# Altium project Full_Power_Board.PrjPcb
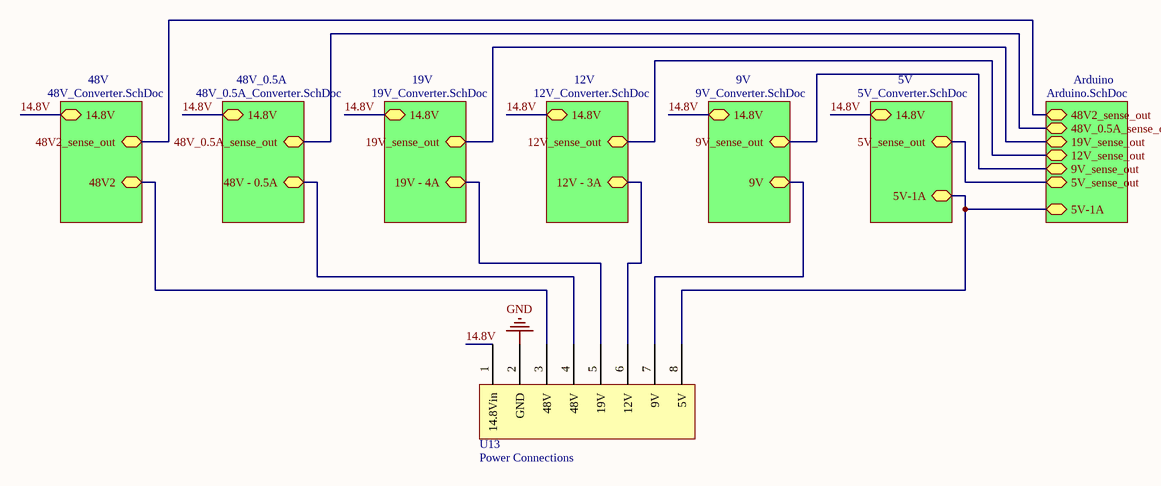
[diagram p0: Full_Power_Board.SchDoc]
2 sheets, 6 parts. Net scope: hierarchical (ports join the sheet entries above them; power ports are global).
Board file: Full_Power_Board.PcbDoc
Sheets:
  Full_Power_Board.SchDoc
    5V = 5V_Converter.SchDoc

## Sheet Full_Power_Board.SchDoc
size A

### Parts
U13  Power Connections  [Molex Connector]

### Sub-sheets
5V = 5V_Converter.SchDoc: 14.8V, 5V_sense_out, 5V-1A
9V = 9V_Converter.SchDoc (file not in this document): 14.8V, 9V_sense_out, 9V
12V = 12V_Converter.SchDoc (file not in this document): 14.8V, 12V_sense_out, 12V - 3A
19V = 19V_Converter.SchDoc (file not in this document): 14.8V, 19V_sense_out, 19V - 4A
48V = 48V_Converter.SchDoc (file not in this document): 14.8V, 48V2, 48V2_sense_out
48V_0.5A = 48V_0.5A_Converter.SchDoc (file not in this document): 14.8V, 48V - 0.5A, 48V_0.5A_sense_out
Arduino = Arduino.SchDoc (file not in this document): 5V-1A, 5V_sense_out, 9V_sense_out, 12V_sense_out, 19V_sense_out, 48V_0.5A_sense_out, 48V2_sense_out

### Nets
GND: U13.2(GND)
14.8V: U13.1(14.8Vin) ; sheet 48V/14.8V, sheet 48V_0.5A/14.8V, sheet 19V/14.8V, sheet 12V/14.8V, sheet 9V/14.8V, sheet 5V/14.8V
NetR1_2: U13.8(5V) ; sheet 5V/5V-1A, sheet Arduino/5V-1A
NetU2_5: sheet 5V/5V_sense_out, sheet Arduino/5V_sense_out
NetU13_3: U13.3(48V) ; sheet 48V/48V2
NetU13_4: U13.4(48V) ; sheet 48V_0.5A/48V - 0.5A
NetU13_5: U13.5(19V) ; sheet 19V/19V - 4A
NetU13_6: U13.6(12V) ; sheet 12V/12V - 3A
NetU13_7: U13.7(9V) ; sheet 9V/9V
(unnamed): sheet 48V/48V2_sense_out, sheet Arduino/48V2_sense_out
(unnamed): sheet 48V_0.5A/48V_0.5A_sense_out, sheet Arduino/48V_0.5A_sense_out
(unnamed): sheet 19V/19V_sense_out, sheet Arduino/19V_sense_out
(unnamed): sheet 12V/12V_sense_out, sheet Arduino/12V_sense_out
(unnamed): sheet 9V/9V_sense_out, sheet Arduino/9V_sense_out

### Library data of the parts
U13 = Molex Connector

## Sheet 5V_Converter.SchDoc
size A
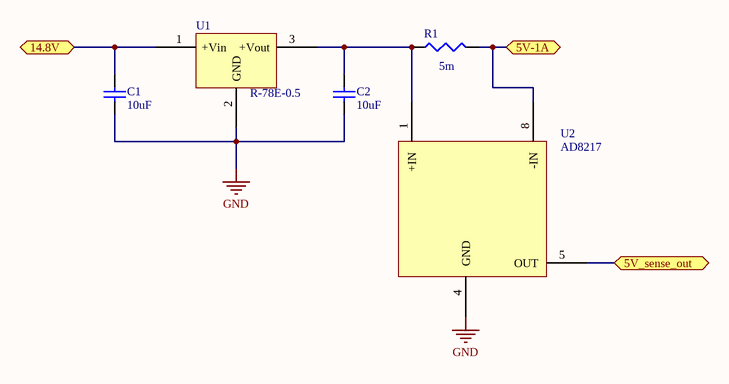
[diagram p1: 5V_Converter.SchDoc]

### Parts
C1  10uF  [C1206]
C2  10uF  [C1206]
R1  value 5m  [J1-0603]  (hidden comment: Res3)
U1  R-78E-0.5  [R-78E-0.5]
U2  AD8217  [AD8217]

### Ports
5V-1A, 5V_sense_out, 14.8V

### Nets
GND: C1.1 C2.1 U1.2(GND) U2.4(GND)
14.8V: C1.2 U1.1(+Vin) ; port 14.8V
NetC2_2: C2.2 R1.1 U1.3(+Vout) U2.1(+IN)
NetR1_2: R1.2 U2.8(-IN) ; port 5V-1A
NetU2_5: U2.5(OUT) ; port 5V_sense_out

### Library data of the parts
C1 C2 = Cap Semi: Capacitor (Semiconductor SIM Model); Published: 8-Jun-2000; LatestRevisionDate: 29-May-2009; LatestRevisionNote: IPC-7351 Footprint Added.; PackageReference: C1206; Publisher: Altium Limited; PackageDescription: Chip Capacitor; Value: 10uF
R1 = Res3: Resistor; Published: 8-Jun-2000; LatestRevisionDate: 29-May-2009; LatestRevisionNote: IPC-7351 Footprint Added.; PackageReference: J1-0603; Publisher: Altium Limited; PackageDescription: Chip Resistor
U1 = R-78E-0.5: DC/DC Converter
U2 = AD8217: Current Shunt Moniter

## Nets that join several sheets
GND: Full_Power_Board (U13.2), 5V_Converter (C1.1 C2.1 U1.2 U2.4)
14.8V: Full_Power_Board (U13.1), 5V_Converter (C1.2 U1.1)
NetR1_2: Full_Power_Board (U13.8), 5V_Converter (R1.2 U2.8)